# Altium schematic sheet Power.SchDoc
size A4; SheetNumber: 4; SheetTotal: 7
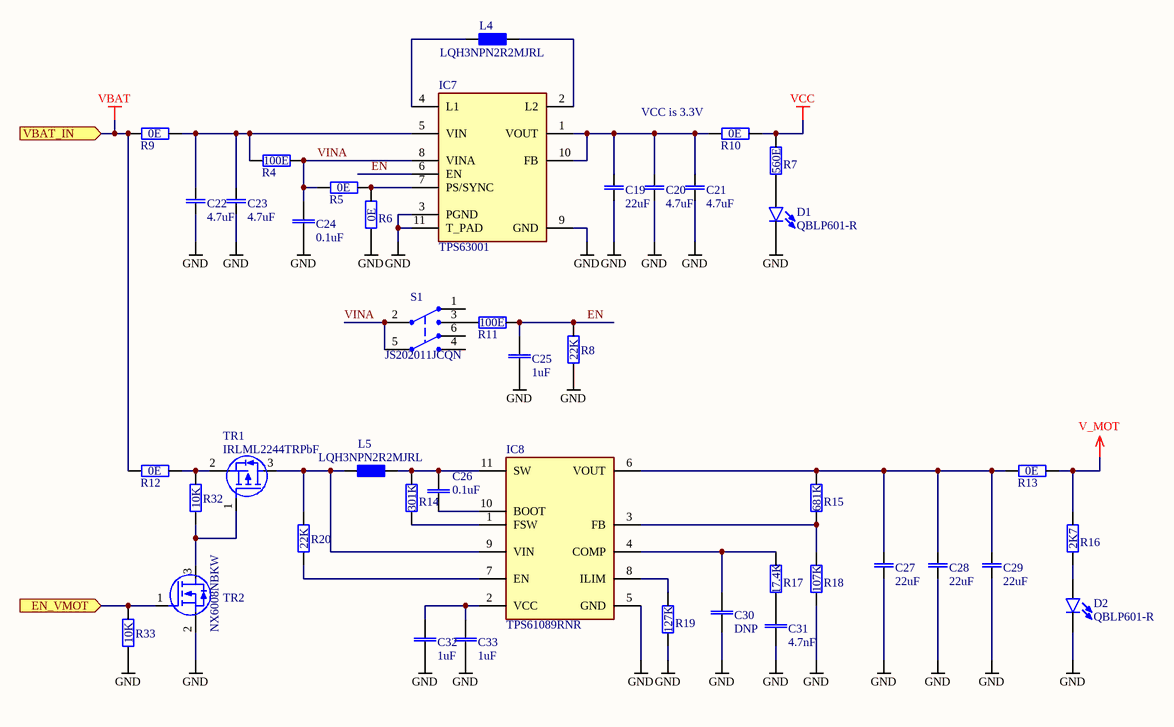
[diagram p0: Power.SchDoc]

## Parts
C19  22uF  [0805]
C20  4.7uF  [0805]
C21  4.7uF  [0805]
C22  4.7uF  [0805]
C23  4.7uF  [0805]
C24  0.1uF  [CAP0402]
C25  1uF  [CAP0402]
C26  0.1uF  [CAP0402]
C27  22uF  [0805]
C28  22uF  [0805]
C29  22uF  [0805]
C30  DNP  [CAP0402]
C31  4.7nF  [CAP0402]
C32  1uF  [CAP0402]
C33  1uF  [CAP0402]
D1  QBLP601-R  [LED0603]
D2  QBLP601-R  [LED0603]
IC7  TPS63001  [VSON10(TPS63001)]
IC8  TPS61089RNR  [VQFN12_HOTROD(TPS61089)]
L4  LQH3NPN2R2MJRL  [INDP3030X02N]
L5  LQH3NPN2R2MJRL  [INDP3030X02N]
R4  100E  [RES0402]  (value not drawn)
R5  0E  [RES0402]  (value not drawn)
R6  0E  [RES0402]  (value not drawn)
R7  560E  [RES0402]  (value not drawn)
R8  22K  [RES0402]  (value not drawn)
R9  0E  [RES0402]  (value not drawn)
R10  0E  [RES0402]  (value not drawn)
R11  100E  [RES0402]  (value not drawn)
R12  0E  [RES0402]  (value not drawn)
R13  0E  [RES0402]  (value not drawn)
R14  301K  [RES0402]  (value not drawn)
R15  681K  [RES0402]  (value not drawn)
R16  2K7  [RES0402]  (value not drawn)
R17  17.4K  [RES0402]  (value not drawn)
R18  107K  [RES0402]  (value not drawn)
R19  127K  [RES0402]  (value not drawn)
R20  22K  [RES0402]  (value not drawn)
R32  10K  [RES0402]  (value not drawn)
R33  10K  [RES0402]  (value not drawn)
S1  JS202011JCQN  [JS202011JCQN]
TR1  IRLML2244TRPbF  [SOT23(IRLM2244T)]
TR2  NX6008NBKW  [SOT323/SC-70(NX6008NBKW)]

## Ports
EN_VMOT (in), VBAT_IN (in)

## Nets
GND: C19.1 C20.1 C21.1 C22.1 C23.1 C24.1 C25.1 C27.1 C28.1 C29.1 C30.2 C31.2 C32.2 C33.2 D1.2 D2.2 IC7.3(PGND) IC7.9(GND) IC7.11(T_PAD) IC8.5(GND) R6.1 R8.1 R18.1 R19.1 R33.1 TR2.2(S)
V_MOT: R13.2 R16.2
VBAT: R9.1 R12.1 ; port VBAT_IN
VCC: R7.2 R10.2
EN: C25.2 IC7.6(EN) R8.2 R11.2
EN_VMOT: R33.2 TR2.1(G) ; port EN_VMOT
VINA: C24.2 IC7.8(VINA) R4.2 R5.1 S1.2 S1.5
NetC19_2: C19.2 C20.2 C21.2 IC7.1(VOUT) IC7.10(FB) R10.1
NetC22_2: C22.2 C23.2 IC7.5(VIN) R4.1 R9.2
NetC26_1: C26.1 IC8.10(BOOT)
NetC26_2: C26.2 IC8.11(SW) L5.2 R14.2
NetC27_2: C27.2 C28.2 C29.2 IC8.6(VOUT) R13.1 R15.2
NetC30_1: C30.1 IC8.4(COMP) R17.2
NetC31_1: C31.1 R17.1
NetC32_1: C32.1 C33.1 IC8.2(VCC)
NetD1_1: D1.1 R7.1
NetD2_1: D2.1 R16.1
NetIC7_2: IC7.2(L2) L4.2
NetIC7_4: IC7.4(L1) L4.1
NetIC7_7: IC7.7(PS/SYNC) R5.2 R6.2
NetIC8_1: IC8.1(FSW) R14.1
NetIC8_3: IC8.3(FB) R15.1 R18.2
NetIC8_7: IC8.7(EN) R20.1
NetIC8_8: IC8.8(ILIM) R19.2
NetIC8_9: IC8.9(VIN) L5.1 R20.2 TR1.3(D)
NetR11_1: R11.1 S1.3
NetR12_2: R12.2 R32.2 TR1.2(S)
NetR32_1: R32.1 TR1.1(G) TR2.3(D)

Not connected (* = marked no-connect by the designer): S1 1 4 6

## Notes on the sheet
- (near R10) VCC is 3.3V

## Library data of the parts
C19 C27-C29 = 000095: Part Number: 000095; Manufacturer: Murata Electronics; Manufacturer Partnummber: GRM21BR61E226ME44K; Component Type: Standard; ComponentLink1Description: Datasheet; ComponentLink2Description: Manufacturer Site; Value: 22uF; Digikey Number: 490-14661-1-ND
C20-C23 = 000090: Part Number: 000090; Manufacturer: Samsung Electro-Mechanics; Manufacturer Partnummber: CL21A475KOFNNNE; Component Type: Standard; ComponentLink1Description: Datasheet; ComponentLink2Description: Manufacturer Site; Value: 4.7uF; Digikey Number: 1276-1065-1-ND
C24 C26 = CAP_0402: Manufacturer: Samsung Electro-Mechanics; Manufacturer Partnummber: CL05A104KA5NNNC; Value: 0.1uF
C25 C32 C33 = CAP_0402: Manufacturer: Samsung Electro-Mechanics; Manufacturer Partnummber: CL05A105KO5NNNC; Value: 1uF
C30 = CAP_0402: Value: DNP
C31 = CAP_0402: Manufacturer: Samsung Electro-Mechanics; Manufacturer Partnummber: CL05B472KB5VPNC; Value: 4.7nF
D1 D2 = QBLP601-R: Manufacturer: QT Brightek (QTB); Manufacturer Partnummber: QBLP601-R
IC7 = TPS63001: Manufacturer: Texas Instruments; Manufacturer Partnummber: TPS63001DRCR
IC8 = TPS61089: Manufacturer: Texas Instruments; Manufacturer Partnummber: TPS61089RNRR
L4 L5 = LQH3NPN2R2MJRL: Manufacturer: Murata Electronics; Value: LQH3NPN2R2MJRL; MPN: LQH3NPN2R2MJRL; Manufacturer Partnummber: LQH3NPN2R2MJRL
R4 R11 = RES_0402: Manufacturer: YAGEO; Manufacturer Partnummber: RC0402FR-07100RL; Value: 100E
R5 R6 R9 R10 R12 R13 = RES_0402: Manufacturer: YAGEO; Manufacturer Partnummber: RC0402JR-070RL; Value: 0E
R7 = RES_0402: Manufacturer: YAGEO; Manufacturer Partnummber: RC0402FR-07560RL; Value: 560E
R8 R20 = RES_0402: Manufacturer: YAGEO; Manufacturer Partnummber: RC0402FR-0722KL; Value: 22K
R14 = RES_0402: Manufacturer: YAGEO; Manufacturer Partnummber: RC0402FR-07301KL; Value: 301K
R15 = RES_0402: Manufacturer: YAGEO; Manufacturer Partnummber: RC0402FR-07681KL; Value: 681K
R16 = RES_0402: Manufacturer: YAGEO; Manufacturer Partnummber: RC0402FR-072K7L; Value: 2K7
R17 = RES_0402: Manufacturer: YAGEO; Manufacturer Partnummber: RC0402FR-0717K4L; Value: 17.4K
R18 = RES_0402: Manufacturer: YAGEO; Manufacturer Partnummber: RC0402FR-07107KL; Value: 107K
R19 = RES_0402: Manufacturer: YAGEO; Manufacturer Partnummber: RC0402FR-07127KL; Value: 127K
R32 R33 = RES_0402: Manufacturer: YAGEO; Manufacturer Partnummber: RC0402FR-0710KL; Value: 10K
S1 = JS202011JCQN: Manufacturer: C&K; Manufacturer Partnummber: JS202011JCQN
TR1 = IRLML2244TRPbF: Manufacturer: Infineon Technologies; Value: IRLML2244TRPbF; Manufacturer Partnummber: IRLML2244TRPBF
TR2 = NX6008NBKW: Value: NX6008NBKW